# EasyEDA Pro project ProPrj_red-panda-afm_2025-05-21.epro, schematic Schematic2
Board Name: PowerAndControl; Create Date: 2024-12-08; Page Name: P1; Project Name: red-panda-afm; Schematic Name: Schematic2; Update Date: 2025-01-17; Company: EasyEDA.com; Drawn: EasyEDA; Page Size: A4; Part Number: JLCPCB-002; Reviewed: EasyEDA; Version: V0.1
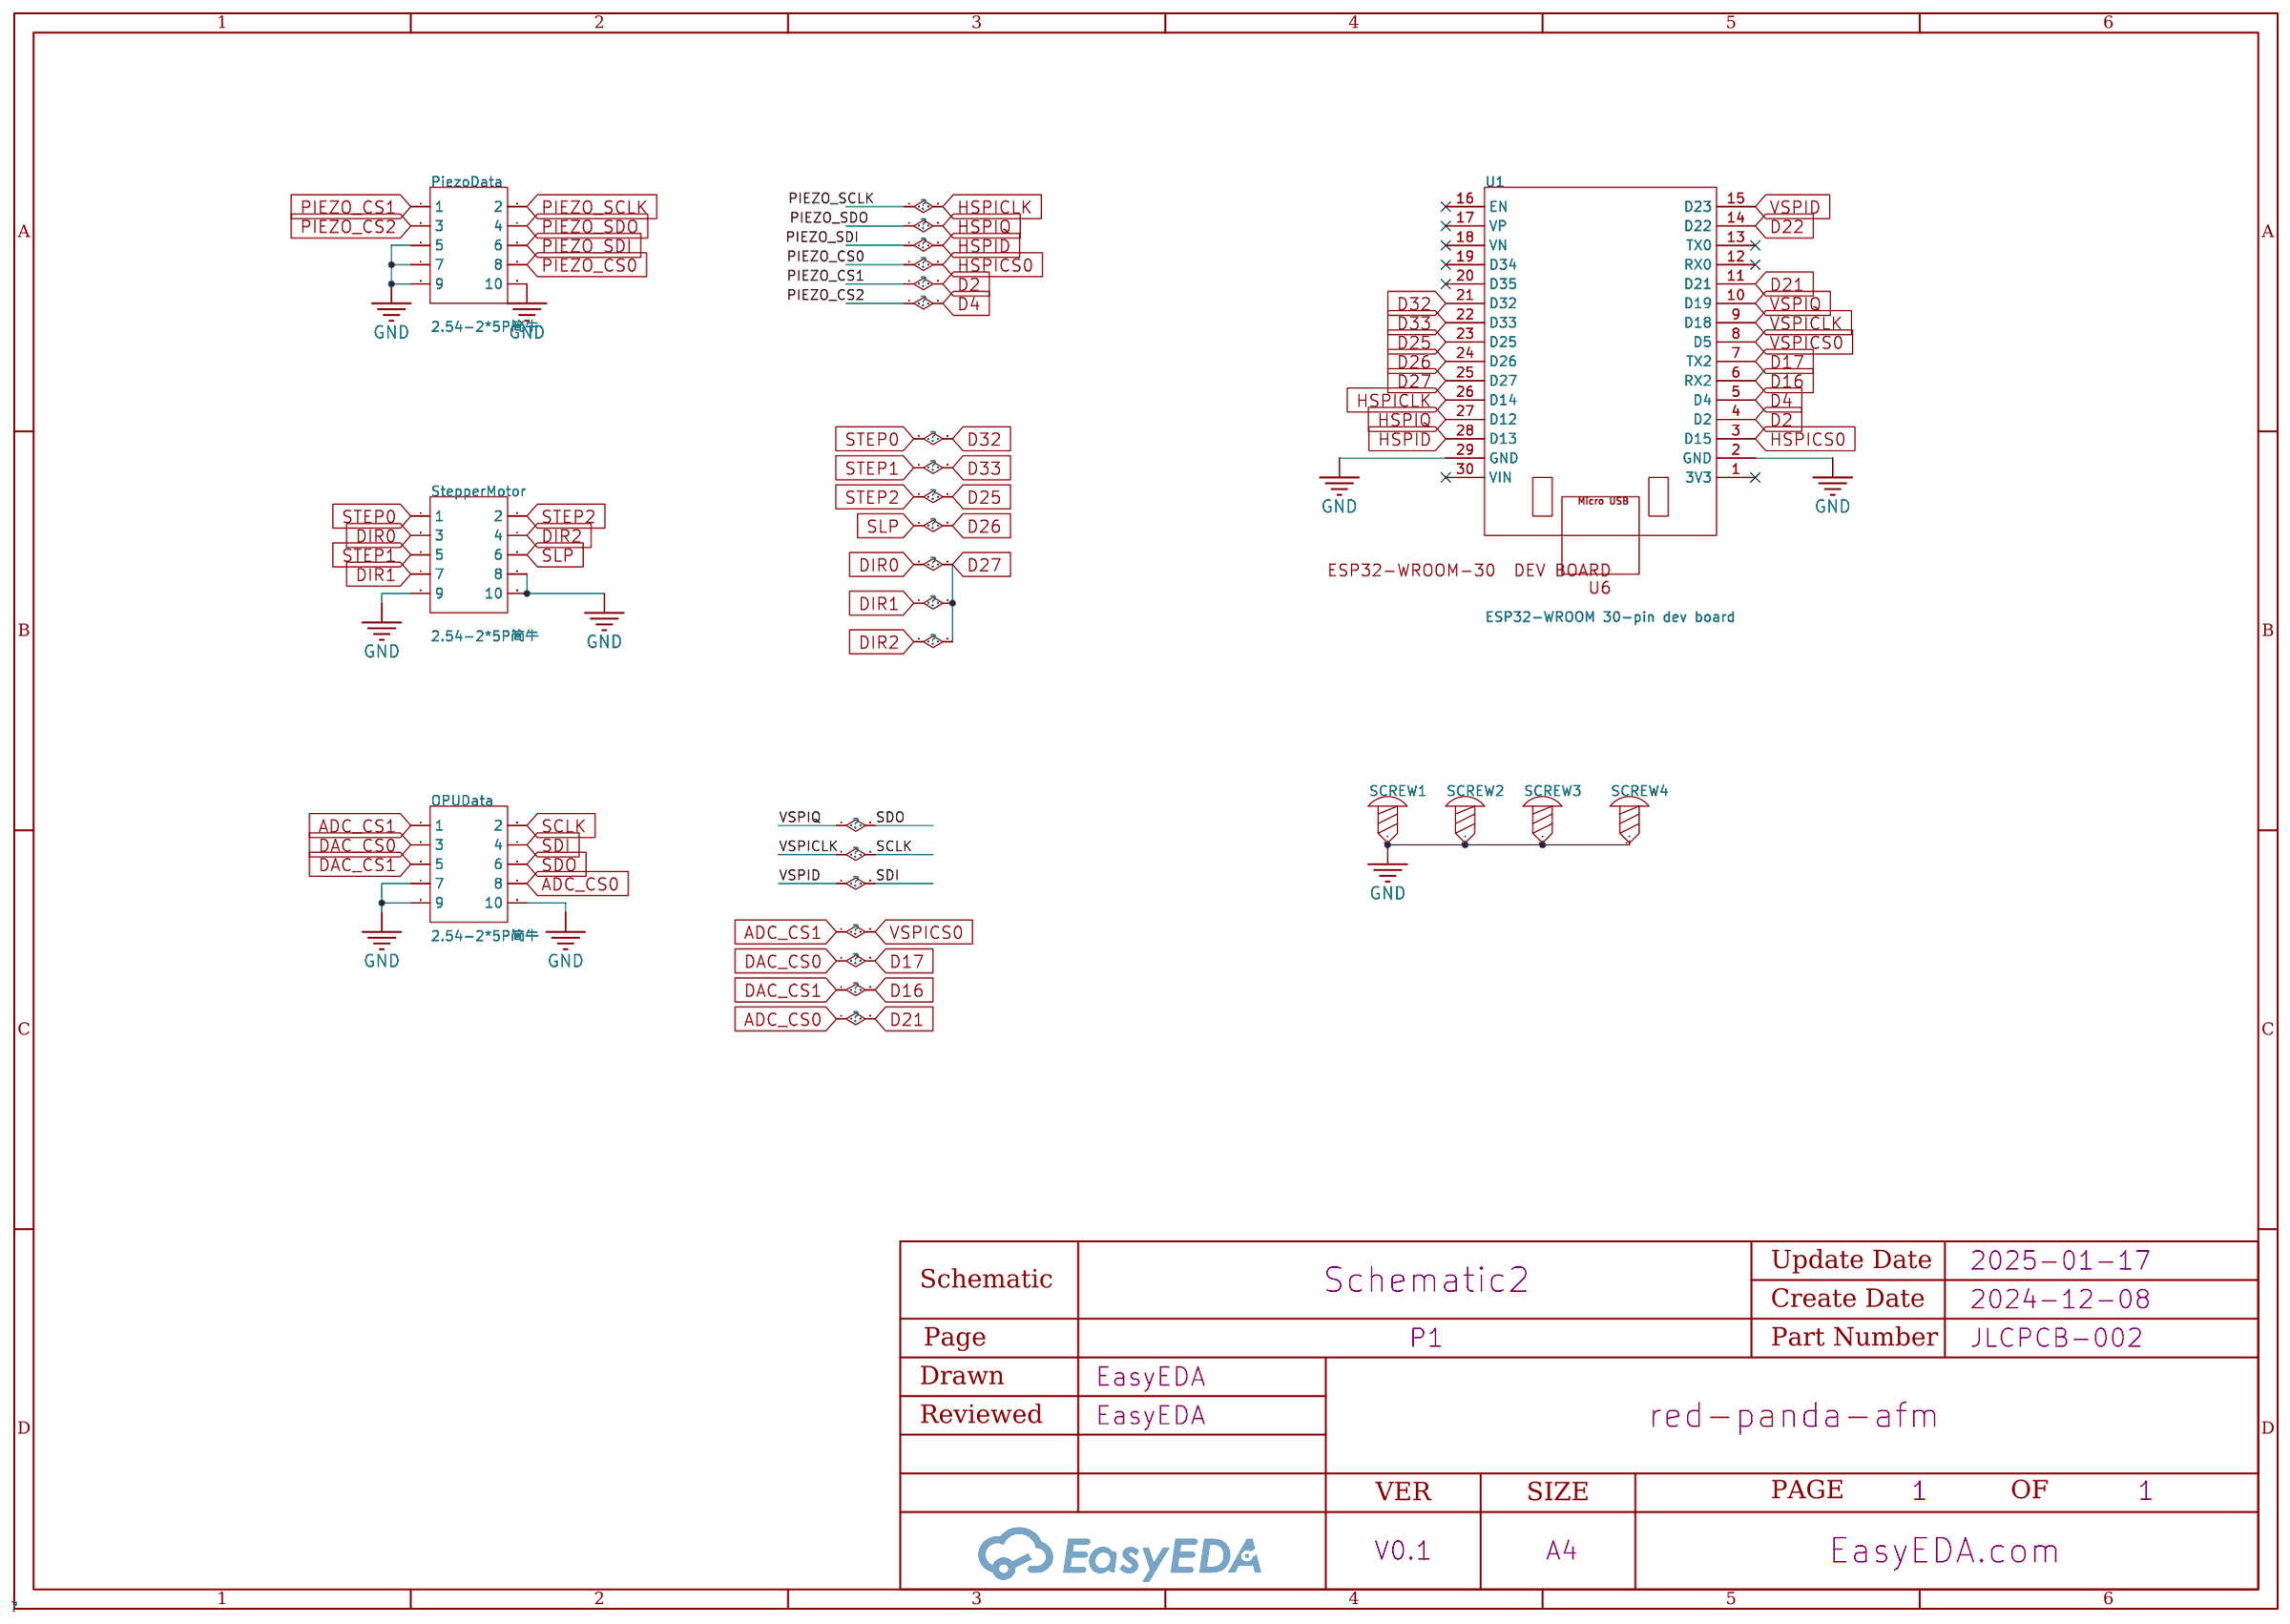
[diagram p3: schematic sheet]

## Parts
OPUData  2.54-2*5P简牛  [IDC-TH_10P-P2.54_C5665]
PiezoData  2.54-2*5P简牛  [IDC-TH_10P-P2.54_C5665]
SCREW1  -  [Screw-Hole-M3]
SCREW2  -  [Screw-Hole-M3]
SCREW3  -  [Screw-Hole-M3]
SCREW4  -  [Screw-Hole-M3]
StepperMotor  2.54-2*5P简牛  [IDC-TH_10P-P2.54_C5665]
U1  ESP32-WROOM 30-pin dev board  [ESP32-WROOM-30-DEVBOARD]

## Library data of the parts
OPUData PiezoData StepperMotor = 2.54-2*5P简牛: Connector Type:简牛座 Pitch:2.54mm Structure:2x5P Holder Type:Straight Row Spacing:2.54mm Number of Rows:2 Pin Number in each Row:5 Contact Material:- Contact Plating:-; LCSC Part Name: 2.54mm 2x5P 排数:2 每排P数:5; Supplier Part: C5665; Manufacturer: BOOMELE(博穆精密); Supplier Footprint: 插件,P=2.54mm; JLCPCB Part Class: Extended Part; Datasheet: https://atta.szlcsc.com/upload/public/pdf/source/20140331/1457707037896.pdf; Supplier: LCSC; Connector Type: 简牛座; Pitch: 2.54mm; Structure: 2x5P; Holder Type: Straight; Row Spacing: 2.54mm; Number of Rows: 2; Pin Number in each Row: 5
SCREW1-SCREW4 = Screw-Hole-M3: Supplier Footprint: 插件
U1 = ESP32-WROOM 30-pin dev board

## Nets
GND: OPUData.7 OPUData.9 OPUData.10 PiezoData.5 PiezoData.7 PiezoData.9 PiezoData.10 SCREW1.1 SCREW2.1 SCREW3.1 SCREW4.1 StepperMotor.8 StepperMotor.9 StepperMotor.10 U1.2(GND) U1.29(GND)
ADC_CS0: OPUData.8 U1.11(D21)
ADC_CS1: OPUData.1 U1.8(D5)
D2: PiezoData.1 U1.4(D2)
D4: PiezoData.3 U1.5(D4)
D16: OPUData.5 U1.6(RX2)
D17: OPUData.3 U1.7(TX2)
D22: U1.14(D22)
D25: StepperMotor.2 U1.23(D25)
D26: StepperMotor.6 U1.24(D26)
D27: StepperMotor.3 StepperMotor.4 StepperMotor.7 U1.25(D27)
D32: StepperMotor.1 U1.21(D32)
D33: StepperMotor.5 U1.22(D33)
HSPICLK: PiezoData.2 U1.26(D14)
HSPICS0: PiezoData.8 U1.3(D15)
HSPID: PiezoData.6 U1.28(D13)
HSPIQ: PiezoData.4 U1.27(D12)
SCLK: OPUData.2 U1.9(D18)
SDI: OPUData.4 U1.15(D23)
SDO: OPUData.6 U1.10(D19)

Not connected (* = marked no-connect by the designer): U1 1(3V3)* 12(RX0)* 13(TX0)* 16(EN)* 17(VP)* 18(VN)* 19(D34)* 20(D35)* 30(VIN)*
